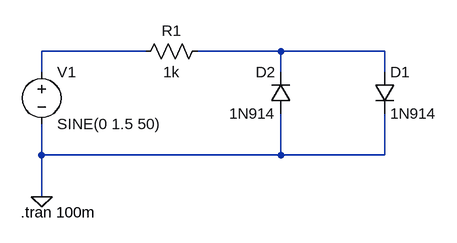
[diagram p0: schematic obmezhuvach.asc]
obmezhuvach.asc, the LTspice schematic file:
Version 4
SHEET 1 880 680
WIRE 160 96 0 96
WIRE 368 96 240 96
WIRE 528 96 368 96
WIRE 0 128 0 96
WIRE 368 128 368 96
WIRE 528 128 528 96
WIRE 0 256 0 208
WIRE 368 256 368 192
WIRE 368 256 0 256
WIRE 528 256 528 192
WIRE 528 256 368 256
WIRE 0 320 0 256
FLAG 0 320 0
SYMBOL res 256 80 R90
WINDOW 0 0 56 VBottom 2
WINDOW 3 32 56 VTop 2
SYMATTR InstName R1
SYMATTR Value 1k
SYMBOL diode 512 128 R0
SYMATTR InstName D1
SYMATTR Value 1N914
SYMBOL diode 384 192 R180
WINDOW 0 24 64 Left 2
WINDOW 3 24 0 Left 2
SYMATTR InstName D2
SYMATTR Value 1N914
SYMBOL voltage 0 112 R0
WINDOW 123 0 0 Left 2
WINDOW 39 0 0 Left 2
SYMATTR InstName V1
SYMATTR Value SINE(0 1.5 50)
TEXT -32 344 Left 2 !.tran 100m

The netlist it stands for:
* obmezhuvach.asc
R1 N002 N001 1k
D1 N002 0 1N914
D2 0 N002 1N914
V1 N001 0 SINE(0 1.5 50)
.model D D
.lib standard.dio
.tran 100m
.backanno
.end